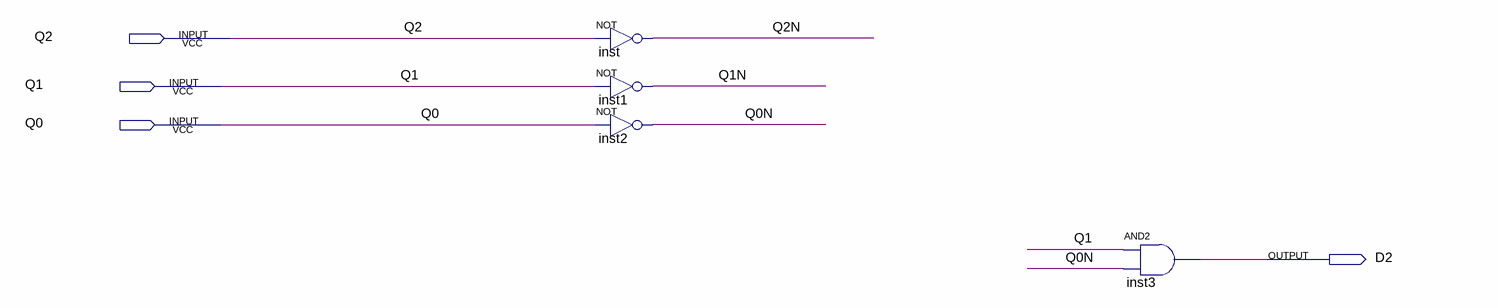
[diagram p0: schematic sheet]
// Quartus schematic D32.bdf as structural Verilog: 4 symbols, 4 pins
module D32 (
  input  Q2,
  input  Q1,
  input  Q0,
  output D2
);

  wire Q0N, Q1N, Q2N;

  not inst (Q2N, Q2);
  not inst1 (Q1N, Q1);
  not inst2 (Q0N, Q0);
  and inst3 (D2, Q1, Q0N);
endmodule
